# EAGLE schematic 01_InputStage_v1 (EAGLE 9.6.2)
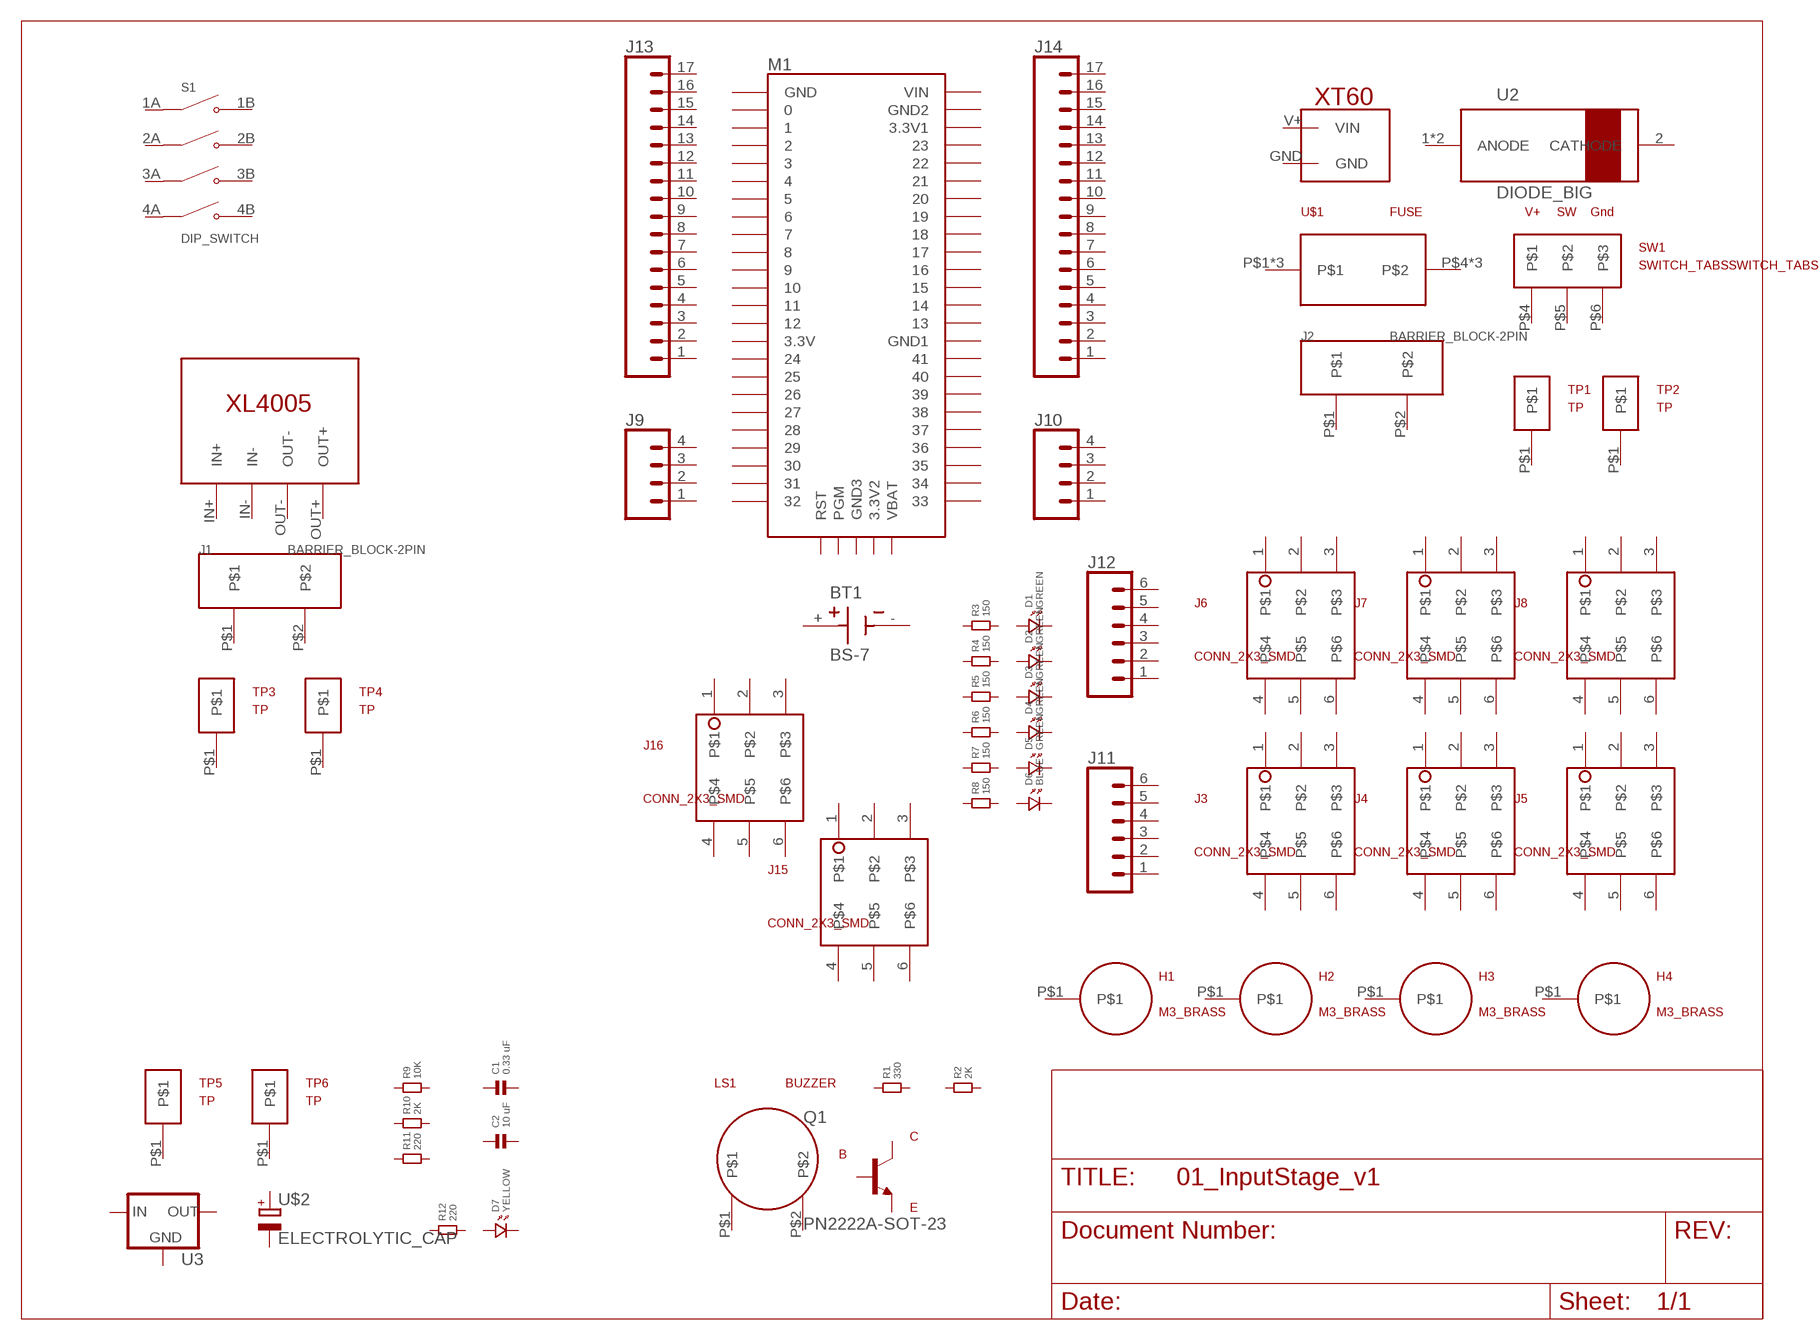
[diagram p0: schematic, sheet 1]

## Parts
BT1  BS-7  [BAT_BS-7]
C1  0.33 uF  CAPACITOR.1206  [1206]
C2  10 uF  CAPACITOR.1206  [1206]
D1  GREEN  LED.1206  [1206.LED]
D2  GREEN  LED.1206  [1206.LED]
D3  GREEN  LED.1206  [1206.LED]
D4  GREEN  LED.1206  [1206.LED]
D5  GREEN  LED.1206  [1206.LED]
D6  BLUE  LED.1206  [1206.LED]
D7  YELLOW  LED.1206  [1206.LED]
H1  M3_BRASS  [M3_BRASS]
H2  M3_BRASS  [M3_BRASS]
H3  M3_BRASS  [M3_BRASS]
H4  M3_BRASS  [M3_BRASS]
J1  BARRIER_BLOCK-2PIN  [BARRIERBLOCK-2PIN]
J2  BARRIER_BLOCK-2PIN  [BARRIERBLOCK-2PIN]
J3  CONN_2X3_SMD  [2X3_SMD_CONNECTOR]
J4  CONN_2X3_SMD  [2X3_SMD_CONNECTOR]
J5  CONN_2X3_SMD  [2X3_SMD_CONNECTOR]
J6  CONN_2X3_SMD  [2X3_SMD_CONNECTOR]
J7  CONN_2X3_SMD  [2X3_SMD_CONNECTOR]
J8  CONN_2X3_SMD  [2X3_SMD_CONNECTOR]
J9  CONN_04  [1X04]
J10  CONN_04  [1X04]
J11  CONN_06  [1X06-SMD_RA_MALE_NO_HOLES]
J12  CONN_06  [1X06-SMD_RA_MALE_NO_HOLES]
J13  CONN_17  [1X17]
J14  CONN_17  [1X17]
J15  CONN_2X3_SMD  [2X3_SMD_CONNECTOR]
J16  CONN_2X3_SMD  [2X3_SMD_CONNECTOR]
LS1  BUZZER  [BUZZER]
M1  TEENSY4.1TEENSY4.1_LONGPADS  [TEENSY4.1_LONGPADS]
Q1  PN2222A-SOT-23  [PN2222A-SOT-23]
R1  330  RESISTOR.1206  [1206]
R2  2K  RESISTOR.1206  [1206]
R3  150  RESISTOR.1206  [1206]
R4  150  RESISTOR.1206  [1206]
R5  150  RESISTOR.1206  [1206]
R6  150  RESISTOR.1206  [1206]
R7  150  RESISTOR.1206  [1206]
R8  150  RESISTOR.1206  [1206]
R9  10K  RESISTOR.1206  [1206]
R10  2K  RESISTOR.1206  [1206]
R11  220  RESISTOR.1206  [1206]
R12  220  RESISTOR.1206  [1206]
S1  DIP_SWITCH  [DIP_SWITCH]
SW1  SWITCH_TABSSWITCH_TABS3  [SWITCH_TABS3]
TP1  TP  [TP]
TP2  TP  [TP]
TP3  TP  [TP]
TP4  TP  [TP]
TP5  TP  [TP]
TP6  TP  [TP]
U1  XL4005-DEV  [XL4005-DEV]
U2  DIODE_BIG  [DIODE_BIG]
U3  V_REG_78XXSINK  [TO220-IGO]
U$1  FUSE  [FUSE]
U$2  ELECTROLYTIC_CAP  [ELECTROLYTIC_CAP]
U$5  XT60  [XT60]
Unconnected: BT1.+ BT1.- C1.1 C1.2 C2.1 C2.2 D1.P$1 D1.P$2 D2.P$1 D2.P$2 D3.P$1 D3.P$2 D4.P$1 D4.P$2 D5.P$1 D5.P$2 D6.P$1 D6.P$2 D7.P$1 D7.P$2 H1.P$1 H2.P$1 H3.P$1 H4.P$1 J1.P$1 J1.P$2 J2.P$1 J2.P$2 J3.1 J3.2 J3.3 J3.4 J3.5 J3.6 J4.1 J4.2 J4.3 J4.4 J4.5 J4.6 J5.1 J5.2 J5.3 J5.4 J5.5 J5.6 J6.1 J6.2 J6.3 J6.4 J6.5 J6.6 J7.1 J7.2 J7.3 J7.4 J7.5 J7.6 J8.1 J8.2 J8.3 J8.4 J8.5 J8.6 J9.1 J9.2 J9.3 J9.4 J10.1 J10.2 J10.3 J10.4 J11.1 J11.2 J11.3 J11.4 J11.5 J11.6 J12.1 J12.2 J12.3 J12.4 J12.5 J12.6 J13.1 J13.2 J13.3 J13.4 J13.5 J13.6 J13.7 J13.8 J13.9 J13.10 J13.11 J13.12 J13.13 J13.14 J13.15 J13.16 J13.17 J14.1 J14.2 J14.3 J14.4 J14.5 J14.6 J14.7 J14.8 J14.9 J14.10 J14.11 J14.12 J14.13 J14.14 J14.15 J14.16 J14.17 J15.1 J15.2 J15.3 J15.4 J15.5 J15.6 J16.1 J16.2 J16.3 J16.4 J16.5 J16.6 LS1.P$1 LS1.P$2 M1.0/RX M1.1/TX M1.2 M1.3 M1.3V3(3.3V) M1.3V3_LO(3.3V1) M1.4 M1.5 M1.6 M1.7 M1.8 M1.9 M1.10/CS M1.11/MOSI M1.12/MISO M1.13/SCK M1.14/A0 M1.15/A1 M1.16/A2 M1.17/A3 M1.18/A4/SDA M1.19/A5/SCL M1.20/A6 M1.21/A7 M1.22/A8 M1.23/A9 M1.24 M1.25 M1.26 M1.27 M1.28 M1.29 M1.30 M1.31/A12 M1.32 M1.33 M1.34 M1.35 M1.36 M1.37 M1.38 M1.39 M1.40 M1.41 M1.AGND(GND2) M1.GND M1.GND1 M1.GND2(GND3) M1.PROG(PGM) M1.RST M1.V33(3.3V2) M1.VBAT M1.VIN Q1.BASE Q1.COLLECTOR Q1.EMITTER R1.1 R1.2 R2.1 R2.2 R3.1 R3.2 R4.1 R4.2 R5.1 R5.2 R6.1 R6.2 R7.1 R7.2 R8.1 R8.2 R9.1 R9.2 R10.1 R10.2 R11.1 R11.2 R12.1 R12.2 S1.1A(COM1) S1.1B(NO1) S1.2A(COM2) S1.2B(NO2) S1.3A(COM3) S1.3B(NO3) S1.4A(COM4) S1.4B(NO4) SW1.P$4 SW1.P$5 SW1.P$6 TP1.P$1 TP2.P$1 TP3.P$1 TP4.P$1 TP5.P$1 TP6.P$1 U1.IN+ U1.IN- U1.OUT+ U1.OUT- U2.1(ANODE) U2.2(CATHODE) U2.3(ANODE) U3.GND U3.IN U3.OUT U$1.P$1 U$1.P$2 U$1.P$3 U$1.P$4 U$1.P$5 U$1.P$6 U$2.+ U$2.- U$5.GND U$5.V+(VIN)

## Library data of the parts
BT1 = Hippo-PS:BS-7: BATTERY HOLDER COIN 20MM PC PIN Check availability <https://pricing.snapeda.com/parts/BS-7/MPD%20%28Memory/view-part?ref=eda>; AVAILABILITY: In Stock; DESCRIPTION: BATTERY HOLDER COIN 20MM PC PIN; MF: MPD (Memory; MP: BS-7; PACKAGE: None; PRICE: None; PURCHASE-URL: https://pricing.snapeda.com/search/part/BS-7/?ref=eda
C1 C2 = standardparts:CAPACITOR
D1-D7 = standardparts:LED
H1-H4 = Hippo-PS:M3_BRASS
J1 J2 = Hippo-PS:BARRIER_BLOCK-2PIN: Barrier block connector Digikey #ED2946-ND
J3-J8 J15 J16 = Hippo-PS:CONN_2X3_SMD
J9 J10 = SparkFun-Connectors:CONN_04: Multi connection point. Often used as Generic Header-pin footprint for 0.1 inch spaced/style header connections On any of the 0.1 inch spaced packages, you can populate with these: Break Away Headers - Straight <https://www.sparkfun.com/products/116> (PRT-00116) Break Away Male Headers - Right Angle <https://www.sparkfun.com/products/553> (PRT-00553) Female Headers <https://www.sparkfun.com/products/115> (PRT-00115) Break Away Headers - Machine Pin <https://www.sparkfun.com/products/117> (PRT-00117) Break Away Female Headers - Swiss Machine Pin <https://www.sparkfun.com/products/743> (PRT-00743) For SCREWTERMINALS and SPRING TERMINALS visit here: Screw Terimnals on SparkFun.com <https://www.sparkfun.com/search/results?term=Screw+Terminals> (5mm/3.5mm/2.54mm spacing) This device is also useful as a general connection point to wire up your design to another part of your project. Our various solder wires solder well into these plated through hole pads. Hook-Up Wire - Assortment (Stranded, 22 AWG) <https://www.sparkfun.com/products/11375> (PRT-11375) Hook-Up Wire - Assortment (Solid Core, 22 AWG) <https://www.sparkfun.com/products/11367> (PRT-11367) View the entire wire category on our website here <https://www.sparkfun.com/categories/141> Special notes: Molex polarized connector foot print use with SKU : PRT-08231 with associated crimp pins and housings. 1MM SMD Version SKU: PRT-10208; PROD_ID: CONN-09696
J11 J12 = Hippo-PS:CONN_06: Multi connection point. Often used as Generic Header-pin footprint for 0.1 inch spaced/style header connections On any of the 0.1 inch spaced packages, you can populate with these: Break Away Headers - Straight <https://www.sparkfun.com/products/116> (PRT-00116) Break Away Male Headers - Right Angle <https://www.sparkfun.com/products/553> (PRT-00553) Female Headers <https://www.sparkfun.com/products/115> (PRT-00115) Break Away Headers - Machine Pin <https://www.sparkfun.com/products/117> (PRT-00117) Break Away Female Headers - Swiss Machine Pin <https://www.sparkfun.com/products/743> (PRT-00743) Arduino Stackable Header - 6 Pin <https://www.sparkfun.com/products/9280> (PRT-09280) For SCREWTERMINALS and SPRING TERMINALS visit here: Screw Terimnals on SparkFun.com <https://www.sparkfun.com/search/results?term=Screw+Terminals> (5mm/3.5mm/2.54mm spacing) This device is also useful as a general connection point to wire up your design to another part of your project. Our various solder wires solder well into these plated through hole pads. Hook-Up Wire - Assortment (Stranded, 22 AWG) <https://www.sparkfun.com/products/11375> (PRT-11375) Hook-Up Wire - Assortment (Solid Core, 22 AWG) <https://www.sparkfun.com/products/11367> (PRT-11367) View the entire wire category on our website here <https://www.sparkfun.com/categories/141>
J13 J14 = SparkFun-Connectors:CONN_17: Multi connection point. Often used as Generic Header-pin footprint for 0.1 inch spaced/style header connections On any of the 0.1 inch spaced packages, you can populate with these: Break Away Headers - Straight <https://www.sparkfun.com/products/116> (PRT-00116) Break Away Male Headers - Right Angle <https://www.sparkfun.com/products/553> (PRT-00553) Female Headers <https://www.sparkfun.com/products/115> (PRT-00115) Break Away Headers - Machine Pin <https://www.sparkfun.com/products/117> (PRT-00117) Break Away Female Headers - Swiss Machine Pin <https://www.sparkfun.com/products/743> (PRT-00743) For SCREWTERMINALS and SPRING TERMINALS visit here: Screw Terimnals on SparkFun.com <https://www.sparkfun.com/search/results?term=Screw+Terminals> (5mm/3.5mm/2.54mm spacing) This device is also useful as a general connection point to wire up your design to another part of your project. Our various solder wires solder well into these plated through hole pads. Hook-Up Wire - Assortment (Stranded, 22 AWG) <https://www.sparkfun.com/products/11375> (PRT-11375) Hook-Up Wire - Assortment (Solid Core, 22 AWG) <https://www.sparkfun.com/products/11367> (PRT-11367) View the entire wire category on our website here <https://www.sparkfun.com/categories/141> Special notes: Molex polarized connector foot print use with SKU : PRT-08231 with associated crimp pins and housings. 1MM SMD Version SKU: PRT-10208 NOTES ON THE VARIANTS LOCK and LOCK_LONGPADS... This footprint was designed to help hold the alignment of a through-hole component (i.e. 6-pin header) while soldering it into place. You may notice that each hole has been shifted either up or down by 0.005 of an inch from it's more standard position (which is a perfectly straight line). This slight alteration caused the pins (the squares in the middle) to touch the edges of the holes. Because they are alternating, it causes a "brace" to hold the component in place. 0.005 has proven to be the perfect amount of "off-center" position when using our standard breakaway headers. Although looks a little odd when you look at the bare footprint, once you have a header in there, the alteration is very hard to notice. Also,if you push a header all the way into place, it is covered up entirely on the bottom side.
LS1 = Hippo-PS:BUZZER
M1 = teensy4.1.dist:TEENSY4.1
Q1 = Hippo-PS:PN2222A-SOT-23: MMBT3904 series 40V 200mA SOT23 NPN Switching Transistor Check availability <https://pricing.snapeda.com/parts/MMBT3904%2C215/Nexperia%20USA/view-part?ref=eda>; AVAILABILITY: In Stock; DESCRIPTION: Bipolar (BJT) Transistor NPN 40 V 200 mA 300MHz 250 mW Surface Mount TO-236AB; MF: Nexperia USA; MP: MMBT3904,215; PACKAGE: SOT23-3 Nexperia USA Inc.; PRICE: None; PURCHASE-URL: https://pricing.snapeda.com/search/part/MMBT3904,215/?ref=eda
R1-R12 = standardparts:RESISTOR
S1 = Hippo-PS:DIP_SWITCH: Check availability <https://pricing.snapeda.com/parts/DS04-254-2-04BK-SMT/CUI%20Devices/view-part?ref=eda>; AVAILABILITY: In Stock; CUI_PURCHASE_URL: https://www.cuidevices.com/product/switches/dip-switches/ds04-254-smt-series?utm_source=snapeda.com&utm_medium=referral&utm_campaign=snapedaBOM; DESCRIPTION: 4 Position, Surface Mount, 2.54 mm Pitch, Flat Slide Actuator, Flat Bottom, SMT Pin, DIP Switch; MF: CUI Devices; MP: DS04-254-2-04BK-SMT; PACKAGE: None; PRICE: None; PURCHASE-URL: https://pricing.snapeda.com/search/part/DS04-254-2-04BK-SMT/?ref=eda
SW1 = Hippo-PS:SWITCH_TABS
TP1-TP6 = Hippo-PS:TP
U1 = Hippo-PS:XL4005-DEV
U2 = Hippo-PS:DIODE_BIG: Check availability <https://pricing.snapeda.com/parts/TS2940CM50%20RNG/Taiwan%20Semiconductor%20Corporation/view-part?ref=eda>; AVAILABILITY: In Stock; DESCRIPTION: 1A 5V ULTRA LOW DROPOUT VOLTAGE REGULATOR; MF: Taiwan Semiconductor Corporation; MP: TS2940CM50 RNG; PACKAGE: TO-263 Taiwan Semiconductor; PRICE: None; PURCHASE-URL: https://pricing.snapeda.com/search/part/TS2940CM50 RNG/?ref=eda
U3 = Hippo-PS:V_REG_78XX: Voltage Regulator Standard 78xx regulator. IGO (Input Ground Output). Spark Fun Electronics SKU : COM-00107
U$1 = Hippo-PS:FUSE
U$2 = Hippo-PS:ELECTROLYTIC_CAP: Check availability <https://pricing.snapeda.com/parts/865080545012/Wurth%20Electronics/view-part?ref=eda>; AVAILABILITY: In Stock; DESCRIPTION: 100 µF 35 V Aluminum Electrolytic Capacitors Radial, Can - SMD - 2000 Hrs @ 105°C; MF: Wurth Electronics; MP: 865080545012; PACKAGE: Radial Würth Elektronik; PRICE: None; PURCHASE-URL: https://pricing.snapeda.com/search/part/865080545012/?ref=eda
U$5 = Hippo-PS:XT60: XT60